# EasyEDA Pro project PCB_Link_Card_2.0.epro

# Board PCB_Link_upgrade
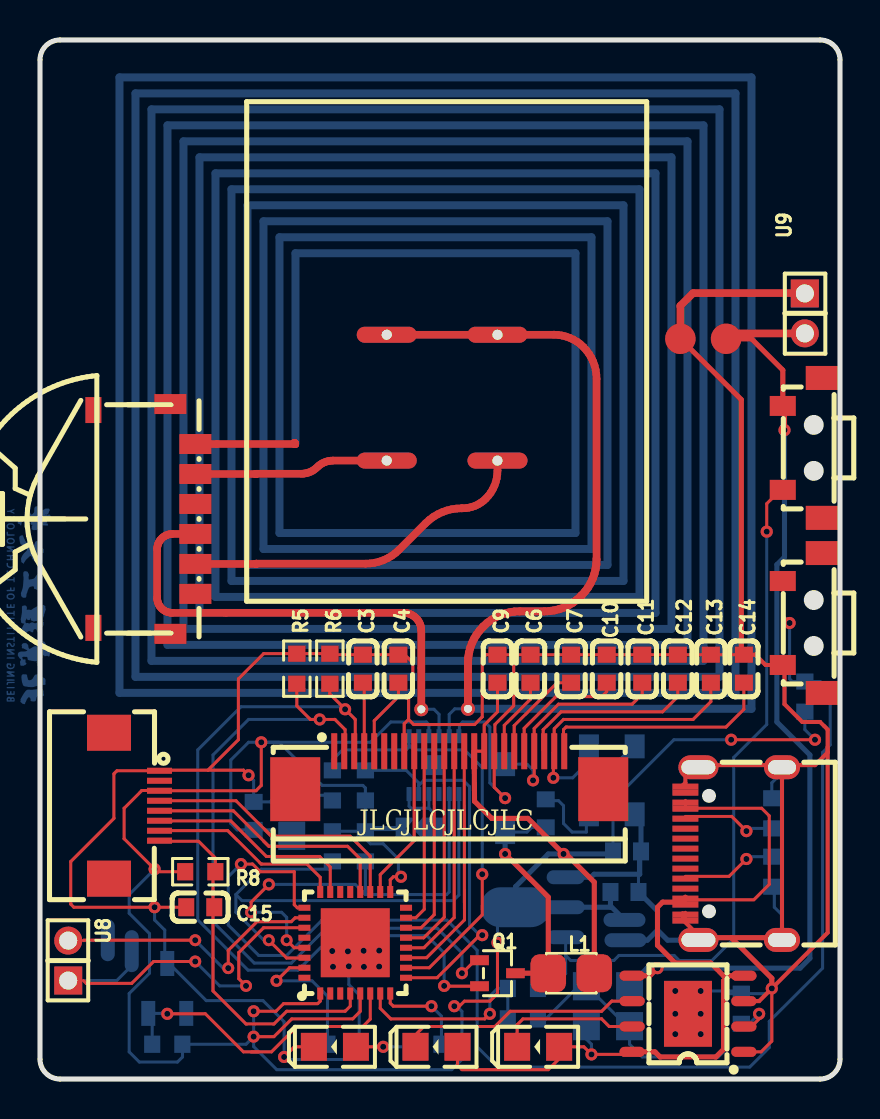
[diagram p0: board, top side]
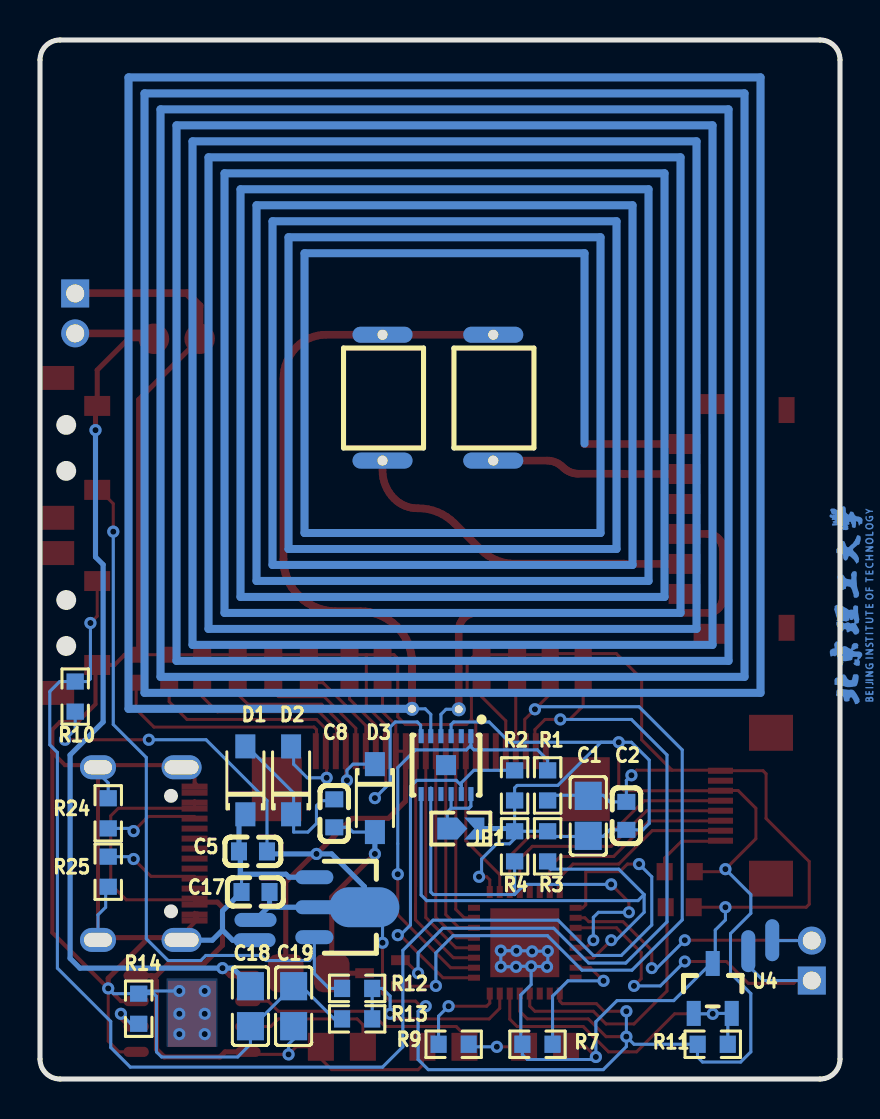
[diagram p1: board, bottom side, seen from below]

Outline 40 x 52 mm; copper layers: Top Layer, Bottom Layer. Coordinates in mm from the lower left corner of the outline.
Outline path: 0,51 0,1 arc(0.29,0.29) 1,0 39,0 arc(39.71,0.29) 40,1 40,51 arc(39.71,51.71) 39,52 1,52 arc(0.29,51.71) 0,51
Stack: Top Layer 0.035mm / Dielectric1 1.51mm FR4 er 4.5 / Bottom Layer 0.035mm

## Design rules (mm)
template: 用户自定义配置
spacing Default (default): track to track 0.152, other pairs 0 to 0.152
track width Default (default): min 0.152, default 0.152, max 25.4
differential pair differentialPair (default): width min 0.127, default 0.254, max 2.54; gap min 0.152, default 0.152
via Default (default): diameter min 0.599, default 0.599, max 100.025; hole min 0.305, default 0.305, max 59.995

## Placement (name value [footprint] x y rotation side)
C1  10u  [C0805]  12.59 13.17 270 bottom
C2  10nf  [C0603]  10.68 13.17 270 bottom
C3  1u  [C0603]  16.14 20.54 90 top
C4  1u  [C0603]  17.92 20.54 90 top
C5  4.7u  [C0603]  29.35 11.39 180 bottom
C6  1u  [C0603]  24.53 20.54 90 top
C7  1u  [C0603]  26.56 20.54 90 top
C8  4.7u  [C0603]  25.29 13.3 90 bottom
C9  0.1u  [C0603]  22.87 20.54 90 top
C10  1u  [C0603]  28.34 20.54 90 top
C11  1u  [C0603]  30.11 20.54 90 top
C12  1u  [C0603]  31.89 20.54 90 top
C13  1u  [C0603]  33.54 20.54 90 top
C14  1u  [C0603]  35.19 20.54 90 top
C15  1u  [C0603]  8.01 8.6 0 top
C17  0.1u  [C0603]  29.22 9.36 180 bottom
C18  10u  [C0805]  29.48 3.64 90 bottom
C19  10u  [C0805]  27.32 3.64 270 bottom
D1  MBR0530  [SOD-123F_L2.7-W1.7-LS3.7-RD-1]  29.73 14.95 90 bottom
D2  MBR0530  [SOD-123F_L2.7-W1.7-LS3.7-RD-1]  27.45 14.95 90 bottom
D3  MBR0530  [SOD-123F_L2.7-W1.7-LS3.7-RD-1]  23.25 14.06 270 bottom
FPC1  KH-CL0.5-H2.0-24PS  [FPC-SMD_24P-P0.50_KINGHELM_KH-CL0.5-H2.0-24PS]  20.46 15.46 0 top
FPC2  0.5K-DX-8PWBG  [FPC-SMD_8P-P0.50_HDGC_0.5K-DX-8PWBG]  4.71 13.68 270 top
JP1  JUMPER  [JUMPER-0603]  18.83 12.53 0 bottom
L1  68uH  [68UH2520]  26.56 5.3 0 top
LED1  LED-0805_B  [LED0805_BLUE]  14.75 1.61 180 top
LED2  LED-0805_R  [LED0805_RED]  24.91 1.61 180 top
LED3  LED-0805_G  [LED0805_GREEN]  19.83 1.61 180 top
NOREF  -  [Pad_e907]  29.27 6.95 90 top
NOREF#2  -  [Pad_e991]  3.39 6.95 180 top
NOREF#3  -  [Pad_e968]  29.22 7.96 90 top
NOREF#4  -  [Pad_e992]  4.59 6.4 0 top
Q1  MOSFET-N+SI1304BDL  [SOT-323-3_L2.0-W1.3-P1.30-LS2.1-BR]  22.87 5.3 180 top
R1  1k  [R0603]  14.62 14.69 270 bottom
R2  20k  [R0603]  16.27 14.69 270 bottom
R3  1k5  [R0603]  14.62 11.65 270 bottom
R4  1k5  [R0603]  16.27 11.65 270 bottom
R5  10k  [R0603]  12.84 20.54 270 top
R6  3R/0.47R  [R0603]  14.49 20.54 270 top
R7  10k  [R0603]  15.13 1.74 0 bottom
R8  10k  [R0603]  8.01 10.38 180 top
R9  1k  [R0603]  19.32 1.74 0 bottom
R10  10k  [R0603]  38.24 19.14 270 bottom
R11  1k  [R0603]  6.36 1.74 0 bottom
R12  1k  [R0603]  24.14 4.53 0 bottom
R13  1k  [R0603]  24.14 3.01 180 bottom
R14  4.7k  [R0603]  35.07 3.52 270 bottom
R24  5.1k  [R0603]  36.59 13.3 90 bottom
R25  5.1k  [R0603]  36.59 10.38 90 bottom
SW2  UK-B0246-SP25Y  [SW-SMD_UK-B0246-SP25Y]  38.11 22.82 270 top
SW3  UK-B0246-SP25Y  [SW-SMD_UK-B0246-SP25Y]  38.11 31.58 270 top
U1  STM32L051K8U6  [UFQFPN-32_L5.0-W5.0-P0.50-BL-EP]  15.76 6.82 0 top
U2  ST25DV16K-JFR6D3  [DFN-12_L3.0-W3.0-P0.50-LS3.0-BL-EP]  19.7 15.71 0 top
U3  Link_NFC  [LINK_NFC]  25.41 39.08 90 top
U4  TL431G-AE3-R  [SOT-23-3_L2.9-W1.3-P1.90-LS2.4-TR]  6.36 4.53 270 bottom
U5  TP4056X_C2763448  [SOP-8_L4.9-W3.9-P1.27-LS6.0-TL-EP-1]  32.4 3.26 180 top
U6  AMS1117S-3.3  [SOT-89-3_L4.5-W2.5-P1.50-LS4.2-BR]  25.03 8.6 0 bottom
U7  502025Li  [502025LI]  20.33 36.16 0 top
U8  hdr-th_2p-p2_00-v-m  [HDR-TH_2P-P2.00-V-M-1]  1.41 5.93 90 top
U9  hdr-th_2p-p2_00-v-m  [HDR-TH_2P-P2.00-V-M-1]  38.24 38.32 270 top
USB2  KH-TYPE-C-16P  [USB-C-SMD_KH-TYPE-C-16P]  34.69 11.28 90 top

## Footprints (pads in the part's own frame, mm; a bottom-side part is the same pattern mirrored in y, then rotated)
68UH2520
  custom 1.778x1.905 smd: 1(1.157,0) 2(-1.143,0)
502025LI
  round 1.524 smd: 1(11.684,0.889) 2(13.97,0.889)
C0603
  rect 0.8x0.9 smd: 1(-0.7,0) 2(0.7,0)
C0805
  rect 1.41x1.35 smd: 1(-1,0) 2(1,0)
DFN-12_L3.0-W3.0-P0.50-LS3.0-BL-EP
  rect 0.254x0.701 smd far side: 1(-1.244,1.448) 2(-0.762,1.448) 3(-0.254,1.448) 4(0.254,1.448) 5(0.762,1.448) 6(1.244,1.448) 7(1.244,-1.448) 8(0.762,-1.448) 9(0.254,-1.448) 10(-0.254,-1.448) 11(-0.762,-1.448) 12(-1.244,-1.448)
  rect 1x1 smd far side: 13(0,0)
FPC-SMD_8P-P0.50_HDGC_0.5K-DX-8PWBG
  rect 0.3x1.25 smd: 1(-1.75,1.262) 2(-1.25,1.262) 3(-0.75,1.262) 4(-0.25,1.263) 5(0.25,1.262) 6(0.75,1.262) 7(1.25,1.263) 8(1.75,1.263)
  rect 1.8x2.2 smd: 9(3.65,-1.263) 10(-3.65,-1.263)
FPC-SMD_24P-P0.50_KINGHELM_KH-CL0.5-H2.0-24PS
  rect 0.3x1.8 smd: 1(-5.75,0.95) 2(-5.25,0.95) 3(-4.75,0.95) 4(-4.25,0.95) 5(-3.75,0.95) 6(-3.25,0.95) 7(-2.75,0.95) 8(-2.25,0.95) 9(-1.75,0.95) 10(-1.25,0.95) 11(-0.75,0.95) 12(-0.25,0.95) 13(0.25,0.95) 14(0.75,0.95) 15(1.25,0.95) 16(1.75,0.95) 17(2.25,0.95) 18(2.75,0.95) 19(3.25,0.95) 20(3.75,0.95) 21(4.25,0.95) 22(4.75,0.95) 23(5.25,0.95) 24(5.75,0.95)
  rect 2.5x3.2 smd: 25(7.7,-0.95) 26(-7.7,-0.95)
HDR-TH_2P-P2.00-V-M-1
  rect 1.4x1.4 hole 0.9: 1(-1,0)
  round 1.4 hole 0.9: 2(1,0)
JUMPER-0603
  custom 1x1.1 smd: 1(-0.8,0)
  custom 1.5x1.1 smd: 2(0.8,0)
LED0805_BLUE
  rect 1.3x1.399 smd: 1(-1.05,0) 2(1.05,0)
LED0805_GREEN
  rect 1.3x1.399 smd: 1(-1.05,0) 2(1.05,0)
LED0805_RED
  rect 1.3x1.399 smd: 1(-1.05,0) 2(1.05,0)
LINK_NFC
  round 0.7 hole 0.4: 1(-20.574,6.35) 2(-20.551,4.015)
  rect 1x1.6 smd: 3(-16.799,18.893) b(-7.299,17.643) c(-8.799,17.643) d(-10.299,17.643) e(-11.799,17.643) f(-13.299,17.643) g(-14.799,17.643) s(-5.299,18.893)
  rect 1.3x0.8 smd: 4(-5.599,22.743) a(-16.499,22.743)
  oval 0.8x3 hole 0.5x0.505: 5(-1.829,8.077) 6(-1.829,2.54) 7(-8.128,2.54) 8(-8.128,8.077)
Pad_e907
  oval 0.7x2.1 smd far side: 34(0,0)
Pad_e968
  oval 0.7x2.1 smd far side: 34(0,0)
Pad_e991
  oval 0.7x2.1 smd far side: 35(0,0)
Pad_e992
  oval 0.7x2.1 smd far side: 36(0,0)
R0603
  rect 0.806x0.864 smd: 1(-0.753,0) 2(0.753,0)
SOD-123F_L2.7-W1.7-LS3.7-RD-1
  rect 1.2x1 smd: 1(-1.7,0) 2(1.7,0)
SOP-8_L4.9-W3.9-P1.27-LS6.0-TL-EP-1
  oval 1.27x0.508 smd: 1(-2.794,1.905) 2(-2.794,0.635) 3(-2.794,-0.635) 4(-2.794,-1.905) 5(2.794,-1.905) 6(2.794,-0.635) 7(2.794,0.635) 8(2.794,1.905)
  rect 2.4x3.3 smd: 9(0,0)
SOT-23-3_L2.9-W1.3-P1.90-LS2.4-TR
  rect 1.25x0.7 smd: 1(1.25,0.95) 2(1.25,-0.95) 3(-1.25,0)
SOT-89-3_L4.5-W2.5-P1.50-LS4.2-BR
  oval 1.9x0.7 smd: 1(1.25,-1.501) 3(1.25,1.501)
  oval 3.5x2 smd: 2(-1.25,0)
  oval 2.1x0.7 smd: 4(1.151,0)
SOT-323-3_L2.0-W1.3-P1.30-LS2.1-BR
  rect 0.936x0.5 smd: 1(0.898,-0.65) 2(0.898,0.65) 3(-0.898,0)
SW-SMD_UK-B0246-SP25Y
  rect 1x1.3 smd: 1(2.1,-0.975) 2(-2.1,-0.975)
  rect 1.2x1.6 smd: 3(-3.5,0.975) 4(3.5,0.975)
UFQFPN-32_L5.0-W5.0-P0.50-BL-EP
  rect 0.3x0.6 smd: 1(-1.75,-2.54) 2(-1.25,-2.54) 3(-0.75,-2.54) 4(-0.25,-2.54) 5(0.25,-2.54) 6(0.75,-2.54) 7(1.25,-2.54) 8(1.75,-2.54) 17(1.75,2.54) 18(1.25,2.54) 19(0.75,2.54) 20(0.25,2.54) 21(-0.25,2.54) 22(-0.75,2.54) 23(-1.25,2.54) 24(-1.75,2.54)
  rect 0.6x0.3 smd: 9(2.54,-1.75) 10(2.54,-1.25) 11(2.54,-0.75) 12(2.54,-0.25) 13(2.54,0.25) 14(2.54,0.75) 15(2.54,1.25) 16(2.54,1.75) 25(-2.54,1.75) 26(-2.54,1.25) 27(-2.54,0.75) 28(-2.54,0.25) 29(-2.54,-0.25) 30(-2.54,-0.75) 31(-2.54,-1.25) 32(-2.54,-1.75)
  rect 3.45x3.45 smd: 33(0,0)
USB-C-SMD_KH-TYPE-C-16P
  oval 1.2x2 hole 0.7x1.7: 1(-4.32,1.765) 2(4.32,1.765)
  oval 1.2x1.8 hole 0.7x1.4: 3(-4.32,-2.415) 4(4.32,-2.415)
  rect 0.3x1.3 smd: A1(-3.35,2.415) A4(-2.55,2.415) A5(-1.25,2.415) A6(-0.25,2.415) A7(0.25,2.415) A8(1.25,2.415) A9(2.55,2.415) A12(3.35,2.415) B1(3.05,2.415) B4(2.25,2.415) B5(1.75,2.415) B6(0.75,2.415) B7(-0.75,2.415) B8(-1.75,2.415) B9(-2.25,2.415) B12(-3.05,2.415)

## Nets
+2.5V: R11.1 U1.6 U4.1 U4.2
+3.3V: C1.2 C2.2 C5.2 C9.1 C17.2 FPC1.15 FPC1.16 FPC2.3 JP1.1 L1.1 NOREF#3.34 R2.2 R3.1 R4.1 R8.2 R10.2 R11.2 U1.1 U1.5 U1.17 U2.3 U6.2 U6.4
+5V: C19.2 LED2.1 LED3.1 U5.4 U5.8 USB2.A4 USB2.A9 USB2.B4 USB2.B9
GND: C1.1 C2.1 C3.2 C4.2 C5.1 C6.2 C7.2 C9.2 C10.2 C11.2 C12.2 C13.2 C14.2 C15.1 C17.1 C18.1 C19.1 D1.1 FPC1.8 FPC1.17 FPC2.1 LED1.2 NOREF.34 R1.2 R5.1 R6.1 R7.2 R13.1 R14.1 R24.2 R25.1 SW2.1 U1.33 U2.6 U4.3 U5.1 U5.3 U6.1 U7.1 U9.1 USB2.1 USB2.2 USB2.3 USB2.4 USB2.A1 USB2.A12 USB2.B1 USB2.B12
VBAT: C18.2 SW3.2 U5.5 U7.2 U9.2
ADC: R12.1 R13.2 U1.7
D_RX: NOREF#4.36 U1.27 U8.1
D_TX: NOREF#2.35 U1.26 U8.2
GDR: FPC1.2 Q1.1 R5.2
IIC1_SCL: R4.2 U1.29 U2.8
IIC1_SDA: R3.2 U1.30 U2.7
INK_BUSY: FPC1.9 U1.18
INK_CLK: FPC1.13 U1.12
INK_CS: FPC1.12 U1.13
INK_DC: FPC1.11 U1.14
INK_MOSI: FPC1.14 U1.11
INK_RST: FPC1.10 U1.15
KEY: R10.1 SW2.2 U1.25
LED: R9.2 U1.8
NRST: C15.2 FPC2.8 R8.1 U1.4
PREVGH: C11.1 D3.1 FPC1.21
PREVGL: C13.1 D2.2 FPC1.23
RESE: FPC1.3 Q1.2 R6.2
RXD: FPC2.4 U1.19
ST25_AC0: U2.4 U3.1
ST25_AC1: U2.5 U3.2
ST25_GPO: R2.1 U1.9 U2.11
ST25_LPD: R1.1 U1.10 U2.1
SWCLK: FPC2.7 U1.24
SWDIO: FPC2.6 U1.23
TXD: FPC2.5 U1.20
$1N199: C8.1 D3.2 L1.2 Q1.3
$1N233: C6.1 FPC1.18
$1N234: C10.1 FPC1.20
$1N239: C14.1 FPC1.24
$1N246: C8.2 D1.2 D2.1
$1N247: C7.1 FPC1.19
$1N248: C12.1 FPC1.22
$1N249: C3.1 FPC1.4
$1N250: C4.1 FPC1.5
$1N293: R7.1 U1.31
$1N388: LED1.1 R9.1
$1N533: R12.2 SW3.1 U6.3
$1N680: R24.1 USB2.B5
$1N681: R25.2 USB2.A5
$1N774: R14.2 U5.2
$1N824: LED3.2 U5.6
$1N825: LED2.2 U5.7
$1N4743: JP1.2 U2.10 U2.12

Pads without a net: FPC1 1 6 7 25 26; FPC2 2 9 10; SW2 3 4; SW3 3 4; U1 2 3 16 21 22 28 32; U2 2 9 13; U3 3 4 5 6 7 8 a b c d e f g s; U5 9; USB2 A6 A7 A8 B6 B7 B8

## Via types
v1: diameter 0.61, hole 0.305, Top Layer to Bottom Layer, 53 vias
v2: diameter 0.599, hole 0.305, Top Layer to Bottom Layer, 7 vias

## Routing (per net, layer and track width the routed paths; a pad name or vN(x,y) marks a point on that pad's centre or on a via; arc(x,y) is an arc through that point)
+2.5V: length 16.9
  Top Layer w0.152: 10.94,1.36 10.17,1.36 8.27,3.26 v1(6.36,3.26) ; 10.56,1.36 11.57,1.36 12.84,2.63 16.14,2.63 16.51,3 16.51,4.28
  Bottom Layer w0.152: 7.19,3.28 7.17,3.26 v1(6.36,3.26) 6.34,3.28 5.29,3.28 5.61,2.96 R11.1
+3.3V: length 147.4
  Top Layer w0.152: v1(20.72,3.64) 20.97,3.64 21.22,3.9 22.49,3.9 22.87,4.28 v1(22.87,6.82) ; v1(10.68,3.39) 11.8,3.39 12.18,3.77 13.88,3.77 14.01,3.9 14.01,4.28 ; 5.73,14.44 5.09,14.44 4.2,13.55 4.2,12.03 v1(5.73,10.5) 5.86,10.38 R8.2 ; v1(10.68,2.12) 11.7,2.12 12.59,3.01 15.63,3.01 16.01,3.39 16.01,4.28 ; 22.87,19.83 22.87,18.38 22.21,17.71 FPC1.16 FPC1.15 ; U1.17 17.51,9.97 17.67,10.12 v1(18.05,10.12) ; 5.98,14.43 10.8,14.43 11.06,14.69 v1(11.06,16.85) ; v1(38.75,16.98) v1(34.56,16.98)
  Top Layer w0.254: FPC1.15 21.73,13.9 22.58,13.04 24.4,13.04 v1(26.18,11.26) 26.3,11.26 27.71,9.85 L1.1
  Bottom Layer w0.152: v1(38.75,16.98) 38.24,17.49 R10.2 ; v1(22.87,6.82) 22.87,7.69 U6.2 ; 28.65,11.39 28.65,13.94 31.69,16.98 v1(34.56,16.98) ; v1(20.72,3.64) 20.84,3.64 21.1,3.39 21.1,0.98 20.59,0.47 11.84,0.47 10.68,1.63 v1(10.68,2.12) ; U2.3 19.44,17.74 19.32,17.87 17.54,17.87 16.52,16.85 10.43,16.85 9.54,15.96 9.54,12.79 9.86,12.47 C2.2 11.51,12.47 11.84,12.14 12.59,12.14 14.36,12.14 R3.1 R4.1 16.27,12.03 16.52,11.77 17.16,11.77 17.92,11.01 17.92,10.25 v1(18.05,10.12) ; 16.27,12.4 R2.2 16.27,14.57 16.14,14.69 14.11,14.69 11.95,16.85 v1(11.06,16.85) ; R11.2 7.13,1.74 ; 7.13,1.74 7.13,1.1 6.87,0.85 4.97,0.85 4.46,1.36 4.46,4.28 5.47,5.3 5.47,7.28 4.46,8.29 4.46,9.23 v1(5.73,10.5) ; 7.13,1.74 10.3,1.74 v1(10.68,2.12) ; v1(10.68,2.12) v1(10.68,3.39)
  Bottom Layer w0.254: 28.52,8.66 28.52,8.6 U6.4 ; 28.52,8.66 C17.2 ; 28.52,8.66 NOREF#3.34 ; R4.1 16.41,12.53 JP1.1 ; C5.2 28.52,11.26 v1(26.18,11.26) 25.41,11.26 23.78,9.63 U6.2
+5V: length 42.6
  Top Layer w0.152: 20.88,1.61 20.88,0.69 21.1,0.47 25.41,0.47 25.96,1.01 LED2.1 27.19,1.61 v1(27.57,1.23) 29.48,1.23 U5.8 ; 32.27,13.94 32.27,13.55 36.08,13.55 36.46,13.17 36.46,9.74 35.69,8.97 32.27,8.97 ; 32.27,8.97 32.27,8.84 ; 32.27,8.97 32.01,8.97 ; 32.27,8.97 32.27,9.14
  Top Layer w0.254: 32.27,9.1 32.03,8.85 31.13,8.85 30.88,8.6 30.88,6.69 31.76,5.8 33.54,5.8 34.18,5.17 34.43,5.17 ; 34.43,5.17 U5.4 ; 34.43,5.17 34.18,4.91 34.18,1.49 33.8,1.1 31,1.1 30.75,1.36 U5.8
  Bottom Layer w0.152: 27.32,2.61 27.32,1.99 27.57,1.74 v1(27.57,1.23)
GND: length 225.1
  Top Layer w0.152: 12.84,21.29 11.18,21.29 9.92,20.03 9.92,16.98 8.4,15.46 ; 18.43,18 18.43,19.14 18.64,19.35 18.64,20.83 18.24,21.24 C4.2 C3.2 14.55,21.24 R6.1 R5.1 ; 18.43,18 18.21,17.78 FPC1.8 ; 18.43,18 18.68,17.74 21.73,17.74 22.11,18.12 22.11,21.04 22.31,21.24 C9.2 23.68,21.24 ; U5.1 36.05,1.36 36.59,1.9 v1(36.59,4.53) ; FPC2.1 6,15.46 8.4,15.46 ; v1(10.43,15.2) 10.17,15.46 8.4,15.46 ; 13.7,1.61 12.71,1.61 v1(12.21,1.1) ; 23.68,21.24 23.68,18.68 22.75,17.74 22.75,16.44 FPC1.17 22.71,14.6 v1(23.25,14.06) ; 23.68,21.24 C6.2 C7.2 C10.2 C11.2 C12.2 C13.2 C14.2 ; C15.1 v1(5.73,8.6) 1.69,8.6 1.54,8.75 1.54,10.88 3.7,13.04 3.7,15.28 3.85,15.43 5.73,15.43 ; 32.27,8.34 32.27,8.04
  Top Layer w0.203: 36.97,7.33 37.1,7.45 37.1,15.71 38.75,15.71 39.38,16.34 39.38,17.49 39,17.87 38.11,17.87 37.22,18.76 37.22,20.63 37.14,20.72 36.28,20.72 35.76,21.24 C14.2 ; 39.38,16.62 39.38,7.33 v1(36.59,4.53) 35.95,3.9 U5.3 ; 32.14,8.3 32.14,7.97 32.78,7.33 32.92,7.33 ; 37.1,15.71 33.04,15.71 ; 32.92,15.97 32.27,15.32 32.27,14.82 32.14,14.7
  Top Layer w0.254: v1(36.59,4.53) 36.59,5.04 34.56,7.07 ; 32.92,7.33 32.92,7.07 34.56,7.07 ; 34.56,7.07 37.09,7.07 ; C14.2 35.07,21.36 35.07,34 U7.1
  Top Layer w0.381: U7.1 32.02,38.7 32.65,39.33 38.22,39.33 U9.1
  Bottom Layer w0.152: 29.92,9.36 29.92,11.26 29.99,11.33 ; v1(5.73,8.6) 5.73,7.96 6.24,7.45 6.24,5.78 6.45,5.78 8.31,3.92 11.15,3.92 12.21,2.87 v1(12.21,1.1) 12.33,0.98 15.63,0.98 15.88,1.22 R7.2 ; v1(14.61,6.41) 14.61,5.66 v1(14.65,5.62) 15.44,5.64 15.44,4.73 15.96,4.21 15.96,1.72 ; v1(10.43,15.2) 10.68,14.95 10.68,13.87 11.51,13.87 11.84,14.2 12.59,14.2 ; v1(33.03,4.41) 34.93,4.41 35.06,4.27 34.31,4.27 34.18,4.13 34.18,1.36 33.92,1.1 30.11,1.1 29.48,1.74 29.48,2.61 29.38,2.61 27.32,4.67 26.95,4.67 25.29,3.01 24.9,3.01 ; v1(16.18,6.42) 15.42,6.42 v1(15.39,6.39) ; 16.2,5.62 16.96,5.63 16.96,6.43 16.18,6.42 ; 37.1,7.33 37.1,8.21 36.72,8.6 36.72,9.5 R25.1 ; R14.1 36.33,4.27 v1(36.59,4.53) ; 14.61,6.41 15.39,6.39 ; v1(16.2,5.61) 16.17,5.64 v1(15.44,5.64) ; R24.2 36.59,14.82 37.1,15.33 37.1,15.97 ; v1(23.25,14.06) 22.49,14.82 22.49,17.61 22.24,17.87 21.13,17.87 20.97,17.71 20.97,17.18 U2.6 ; R1.2 14.36,14.2 12.59,14.2
  Bottom Layer w0.254: 30.88,7.45 30.37,6.95 NOREF.34 ; 30.88,7.45 30.88,8.41 29.92,9.36 ; 30.88,7.45 31.38,6.95 32.91,6.95 USB2.1 ; U6.1 27.55,10.1 27.7,10.25 29.99,10.25 29.99,11.33 C5.1 30.05,12.93 29.73,13.25
  vias: v1(16.96,6.43) v1(16.96,5.63) v1(31.76,4.41) v1(31.76,3.26) v1(31.76,2.25) v1(33.03,3.26) v1(33.03,2.25)
VBAT: length 48.9
  Top Layer w0.254: v1(37.22,32.47) 37.22,33.6 SW3.2 37.14,35.48 35.57,37.05 U7.2 ; U5.5 30.49,5.17 v1(30.88,5.55)
  Top Layer w0.381: U9.2 34.57,37.32 U7.2
  Bottom Layer w0.254: 29.48,4.67 30.35,5.55 v1(30.88,5.55) 38,5.55 38.5,6.04 38.5,16.22 36.84,17.87 36.84,25.74 37.22,26.12 v1(37.22,32.47)
ADC: length 10
  Top Layer w0.152: 17.01,4.28 17.01,3.54 17.54,3.01 22.24,3.01 v1(22.49,3.26)
  Bottom Layer w0.152: v1(22.49,3.26) 22.49,4.15 22.87,4.53 R12.1 R13.2
D_RX: length 18.8
  Top Layer w0.152: 2.17,4.93 2.31,4.79 4.59,4.79 5.68,5.88 v2(7.76,5.88) ; v2(10.3,4.66) 9.94,5.02 9.94,6.33 11.18,7.57 U1.27
  Bottom Layer w0.152: U8.1 3.84,4.93 4.59,5.68 4.59,6.21 ; v2(7.76,5.88) 8.98,4.66 v2(10.3,4.66)
D_TX: length 15.2
  Top Layer w0.152: v2(9.41,5.55) 9.41,6.44 10.85,7.87 12.56,7.87 12.76,8.07 U1.26 ; v2(7.76,6.95) 2.19,6.95 2.17,6.93
  Bottom Layer w0.152: U8.2 3.37,6.93 NOREF#2.35 ; v2(7.76,6.95) 9.16,5.55 v2(9.41,5.55)
GDR: length 36.2
  Top Layer w0.152: Q1.1 21.76,5.95 21.11,5.3 v1(21.1,5.3) ; 12.84,19.78 12.84,18.67 13.52,18 v1(13.98,18) 14.75,18 15.25,17.49 15.25,16.45 FPC1.2
  Bottom Layer w0.152: v1(13.98,18) 10.43,18 8.65,16.22 8.65,7.87 10.71,5.8 12.57,5.8 14.31,7.54 19.86,7.54 21.1,6.31 v1(21.1,5.3)
IIC1_SCL: length 22
  Top Layer w0.152: v1(11.44,9.74) 10.56,8.85 v2(10.56,8.34) ; U1.29 12.71,6.57 v2(12.33,6.95)
  Bottom Layer w0.152: 16.27,9.23 16.27,10.89 ; 16.27,9.23 20.33,9.23 20.46,9.36 20.46,14.57 ; 16.27,9.23 15.76,9.74 v1(11.44,9.74) ; v2(12.33,6.95) 12.33,8.09 12.08,8.34 v2(10.56,8.34)
IIC1_SDA: length 27.4
  Top Layer w0.152: v2(11.44,6.95) 12.33,6.06 13.21,6.06 U1.30
  Bottom Layer w0.152: 9.79,9.23 11.06,10.5 14.47,10.5 14.62,10.66 14.62,10.89 ; 9.79,9.23 10.1,8.93 20.66,8.93 20.94,9.21 U2.7 ; 9.79,9.23 9.79,8.34 11.19,6.95 v2(11.44,6.95)
INK_BUSY: length 7.7
  Top Layer w0.152: 17.01,9.36 17.01,10.23 18.71,11.93 18.71,16.4
INK_CLK: length 11.4
  Top Layer w0.152: FPC1.13 20.71,8.08 19.2,6.57 U1.12
INK_CS: length 10.6
  Top Layer w0.152: FPC1.12 20.21,8.09 19.19,7.07 U1.13
INK_DC: length 9.9
  Top Layer w0.152: FPC1.11 19.71,8.23 19.05,7.57 U1.14
INK_MOSI: length 12.1
  Top Layer w0.152: U1.11 19.33,6.07 21.22,7.96 FPC1.14
INK_RST: length 9
  Top Layer w0.152: FPC1.10 19.21,8.49 18.79,8.07 U1.15
KEY: length 69.5
  Top Layer w0.152: SW2.2 37.14,23.16 v1(37.48,22.82) ; U1.25 12.87,8.57 12.71,8.72 12.71,10.38 11.01,10.38 10.63,10.76 v1(10.05,10.76)
  Bottom Layer w0.152: v1(37.48,22.82) 37.48,20.03 37.61,19.89 R10.1 39.01,19.89 39.51,19.39 39.51,16.73 39.13,16.34 39.13,5.55 36.46,2.88 36.46,1.58 35.48,0.6 22.87,0.6 21.86,1.61 21.86,6.44 20.35,7.95 14.1,7.95 12.33,6.18 10.94,6.18 9.41,7.71 9.41,10.12 v1(10.05,10.76)
LED: length 4.7
  Top Layer w0.152: 17.51,4.28 17.51,3.8 17.67,3.64 v1(19.57,3.64)
  Bottom Layer w0.152: 20.07,1.74 20.07,3.14 v1(19.57,3.64)
NRST: length 18.6
  Top Layer w0.152: 7.93,11.9 8.77,11.06 R8.1 8.65,10.26 8.65,4.41 10.3,2.76 11.7,2.76 12.33,3.39 15.25,3.39 15.51,3.65 15.51,4.28 ; 5.73,11.93 5.75,11.9 6,11.9 ; FPC2.8 6,11.9 ; 6,11.9 7.89,11.9
PREVGH: length 11.3
  Top Layer w0.152: 30.11,19.83 30.11,19.27 29.6,18.76 25.92,18.76 24.71,17.55 FPC1.21 24.71,15.01 v1(24.65,14.95)
  Bottom Layer w0.152: v1(24.65,14.95) 24.65,15.46 24.35,15.76 D3.1
PREVGL: length 14.7
  Top Layer w0.152: v1(25.67,15.07) 25.67,16.36 FPC1.23 25.71,17.53 26.18,18 32.65,18 33.54,18.88 C13.1
  Bottom Layer w0.152: v1(25.67,15.07) 26.63,15.07 27.32,15.76 27.32,16.52 D2.2
RESE: length 38.6
  Top Layer w0.152: Q1.2 20.48,4.65 20.46,4.66 v1(20.21,4.66) ; FPC1.3 15.76,16.46 15.76,18 v1(15.25,18.5) 14.49,19.27 14.49,19.78
  Bottom Layer w0.152: v1(20.21,4.66) 20.21,6.31 19.34,7.18 14.63,7.18 12.9,5.45 10.4,5.45 7.89,7.96 7.89,16.47 10.05,18.63 15.13,18.63 v1(15.25,18.5)
RXD: length 14.2
  Top Layer w0.152: 11.57,12.15 15.51,12.15 16.51,11.15 16.51,9.36 ; 11.57,12.15 9.8,13.93 5.73,13.93 ; 11.57,12.15 11.26,12.47
ST25_AC0: length 2.1
  Bottom Layer w0.152: U3.1 19.7,18.5 19.95,18.25 U2.4
ST25_AC1: length 2.1
  Bottom Layer w0.152: U3.2 20.74,18.53 20.46,18.25 U2.5
ST25_GPO: length 18.7
  Top Layer w0.152: v1(22.11,7.2) 21.98,7.2 19.85,5.07 U1.9
  Bottom Layer w0.152: 18.94,14.69 U2.11 ; 18.94,14.69 19.19,14.95 21.16,14.95 21.48,14.63 21.48,7.71 21.98,7.2 v1(22.11,7.2) ; 18.94,14.69 18.94,14.82 18.31,15.45 16.27,15.45
ST25_LPD: length 21.6
  Top Layer w0.152: U1.10 19.47,5.57 22.11,8.22 v1(22.11,10.25)
  Bottom Layer w0.152: v1(22.11,10.25) 22.11,15.58 21.22,16.47 18.68,16.47 18.45,16.7 ; 18.45,16.7 18.45,16.62 18.3,16.47 15.13,16.47 14.62,15.96 14.62,15.45 ; 18.45,16.7 U2.1
SWCLK: length 10
  Top Layer w0.152: U1.24 14.01,10.09 13.35,10.76 11.06,10.76 9.39,12.43 5.73,12.43
SWDIO: length 11
  Top Layer w0.152: U1.23 14.51,10.61 13.98,11.14 11.32,11.14 9.54,12.92 5.73,12.92
TXD: length 13.3
  Top Layer w0.152: 11.44,11.65 9.67,13.42 5.73,13.42 ; 11.44,11.65 11.19,11.9 ; 11.44,11.65 15.38,11.65 16.01,11.02 16.01,9.36
$1N199: length 11.7
  Top Layer w0.254: Q1.3 L1.2 25.41,9.11 v1(23.25,11.26)
  Bottom Layer w0.152: D3.2 24.35,12.36 24.59,12.6 C8.1
  Bottom Layer w0.254: D3.2 v1(23.25,11.26)
$1N233: length 4
  Top Layer w0.152: 23.21,16.41 23.21,17.7 24.53,19.01 24.53,19.83
$1N234: length 6.5
  Top Layer w0.152: 28.34,19.83 28.34,19.39 28.08,19.14 25.79,19.14 24.21,17.55 24.21,16.41
$1N239: length 11.9
  Top Layer w0.152: 35.19,19.83 35.19,18.5 34.3,17.61 26.3,17.61 26.18,17.49 26.18,16.44 FPC1.24
$1N246: length 8.6
  Bottom Layer w0.152: C8.2 25.35,13.93 25.92,13.93 26.18,13.68 26.18,12.79 26.61,12.36 27.32,12.36 27.32,14.31 29.65,16.65 D1.2
$1N247: length 5
  Top Layer w0.152: 23.71,16.41 23.71,17.69 25.86,19.83 26.56,19.83
$1N248: length 9.2
  Top Layer w0.152: FPC1.22 25.16,16.46 25.16,17.49 26.05,18.38 31.13,18.38 31.89,19.14 C12.1
$1N249: length 3.5
  Top Layer w0.152: 16.14,19.83 16.21,19.83 FPC1.4
$1N250: length 3.9
  Top Layer w0.152: 16.71,16.41 16.71,17.93 17.92,19.14 17.92,19.83
$1N293: length 6.9
  Top Layer w0.152: U1.31 12.48,5.57 v1(11.82,4.91)
  Bottom Layer w0.152: v1(11.82,4.91) 13.6,4.91 14.37,4.15 R7.1
$1N388: length 2.8
  Top Layer w0.152: LED1.1 v1(17.16,1.61)
  Bottom Layer w0.152: v1(17.16,1.61) 18.44,1.61 R9.1
$1N533: length 36.2
  Top Layer w0.152: SW3.1 37.03,29.48 36.34,28.79 v1(36.34,27.39)
  Bottom Layer w0.152: 26.28,6.18 26.28,5.28 25.54,4.53 R12.2 ; 26.28,6.18 U6.3 ; 26.28,6.18 26.54,5.93 28.69,5.93 28.95,6.18 31.71,6.18 31.96,5.93 33.6,5.93 34.69,7.02 34.69,16.09 36.34,17.74 v1(36.34,27.39)
$1N680: length 4.7
  Top Layer w0.152: v1(35.32,12.41) 34.59,13.14 32.27,13.14
  Bottom Layer w0.152: R24.1 35.46,12.54 v1(35.32,12.41)
$1N681: length 4.7
  Top Layer w0.152: v1(35.32,11.01) 34.45,10.14 32.27,10.14
  Bottom Layer w0.152: v1(35.32,11.01) 35.44,11.13 R25.2
$1N774: length 2.3
  Top Layer w0.152: U5.2 35.57,2.63 35.95,3.01 v1(35.95,3.26)
  Bottom Layer w0.152: R14.2 35.46,2.76 v1(35.95,3.26)
$1N824: length 12.1
  Top Layer w0.152: 18.78,1.61 18.78,2.21 19.19,2.63 22.75,2.63 23.51,3.39 28.08,3.39 28.59,3.9 U5.6
$1N825: length 7.1
  Top Layer w0.152: U5.7 28.46,2.63 28.08,3.01 24.15,3.01 23.86,2.72 LED2.2
$1N4743: length 3.4
  Bottom Layer w0.152: U2.10 19.44,13.55 ; 19.44,13.55 19.63,13.36 19.63,12.53 ; 19.44,13.55 18.56,13.55 18.45,13.65 U2.12

## Copper pours and planes (outline as drawn; the poured copper is in the pictures)
GND on Bottom Layer: 31.13,5.04 33.67,5.04 33.67,1.61 31.13,1.61

Small or netless copper shapes (teardrops, artwork), in the pictures only: 35 on Bottom Layer

## Text on the board
Top Silkscreen Layer: JLCJLCJLCJLC
